# Altium schematic sheet Led Driver.SchDoc
size A3; SheetNumber: 12; SheetTotal: 15
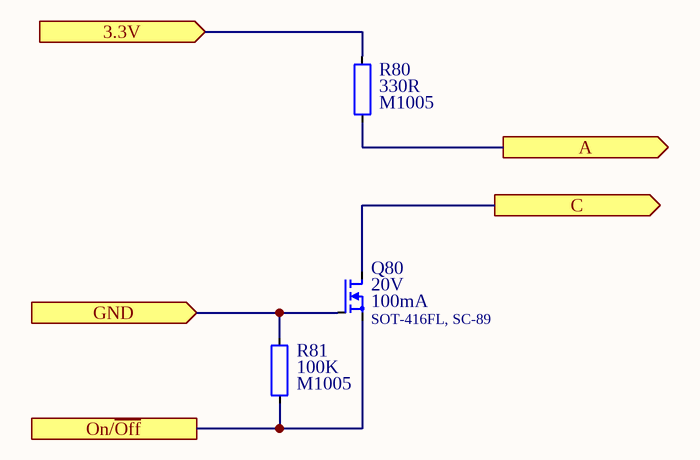
[diagram p0: Led Driver.SchDoc]

## Parts
Q80  Current: 100mA  Voltage: 20V  Package: SOT-416FL, SC-89  [SOT-416FL, Mosfet - Type 1]  (hidden comment: Mosfet, N-Channel)
R80  value 330R  Package: M1005  [Resistor_Smd_M1005_I0402]  (hidden comment: Resistor)
R81  value 100K  Package: M1005  [Resistor_Smd_M1005_I0402]  (hidden comment: Resistor)

## Ports
3.3V (in), A (out), C (out), GND (in), On/~{Off}

## Nets
3.3V: R80.1 ; port 3.3V
A: R80.2 ; port A
C: Q80.D ; port C
GND: Q80.G R81.1 ; port GND
On/~{Off}: Q80.S R81.2 ; port On/~{Off}

## Library data of the parts
Q80 = Mosfet, N-Channel: MOSFET, N-CH, 20V, 100mA, SOT-416FL; Manufacturer Part Number: RE1C001UNTCL; Manufacturer: Rohm; Component Category: Transistor; ComponentLink1Description: Datasheet; ComponentLink1URL: E:\Altium\Datasheets\Transistor\Rohm, RE1C001UN.pdf; ComponentLink2Description: Supplier Link; ComponentLink2URL: https://www.digikey.com/en/products/detail/rohm-semiconductor/RE1C001UNTCL/4004557; Supplier: Digikey; Supplier Part Number: RE1C001UNTCLCT-ND; Operating Temperature, Min: *℃; Operating Temperature, Max: *℃; Quantity, Min: 1; Quantity, Max: 6000; Price, Min: 0.42; Price, Max: 0.0638; Supplier Currency: $; Supplier Link: https://www.digikey.com/en/products/detail/rohm-semiconductor/RE1C001UNTCL/4004557; Component Type: Mosfet
R80 = Resistor: Res, 330R, 1%, M1005; Manufacturer: Yageo; Manufacturer Part Number: RC0402FR-07330RL; Component Category: Resistor; Component Type: Fixed Value; Tolerance: 1%; Supplier Link: https://www.digikey.com/en/products/detail/yageo/RC0402FR-07330RL/726594; Supplier Currency: $; Price, Max: 0.00129; Price, Min: 0.1; Quantity, Max: 100000; Quantity, Min: 1; Operating Temperature, Max: -55℃; Operating Temperature, Min: +155℃; Supplier Part Number: 311-330LRCT-ND; Supplier: Digikey; ComponentLink1Description: Datasheet; ComponentLink1URL: E:\Altium\Datasheets\Resistor\Yageo - RC_L Series.pdf; ComponentLink2Description: Supplier Link; ComponentLink2URL: https://www.digikey.com/en/products/detail/yageo/RC0402FR-07330RL/726594
R81 = Resistor: Res, 100K, 1%, M1005; Manufacturer: Yageo; Manufacturer Part Number: RC0402FR-07100KP; Component Category: Resistor; Component Type: Fixed Value; Tolerance: 1%; Supplier Link: https://www.digikey.com/en/products/detail/yageo/RC0402FR-07100KP/12698883; Supplier Currency: $; Price, Max: 0.00282; Price, Min: 0.1; Quantity, Max: 100000; Quantity, Min: 1; Operating Temperature, Max: -55℃; Operating Temperature, Min: +155℃; Supplier Part Number: 13-RC0402FR-07100KPCT-ND; Supplier: Digikey; ComponentLink1Description: Datasheet; ComponentLink1URL: E:\Altium\Datasheets\Resistor\Yageo - RC_L Series.pdf; ComponentLink2Description: Supplier Link; ComponentLink2URL: https://www.digikey.com/en/products/detail/yageo/RC0402FR-07100KP/12698883